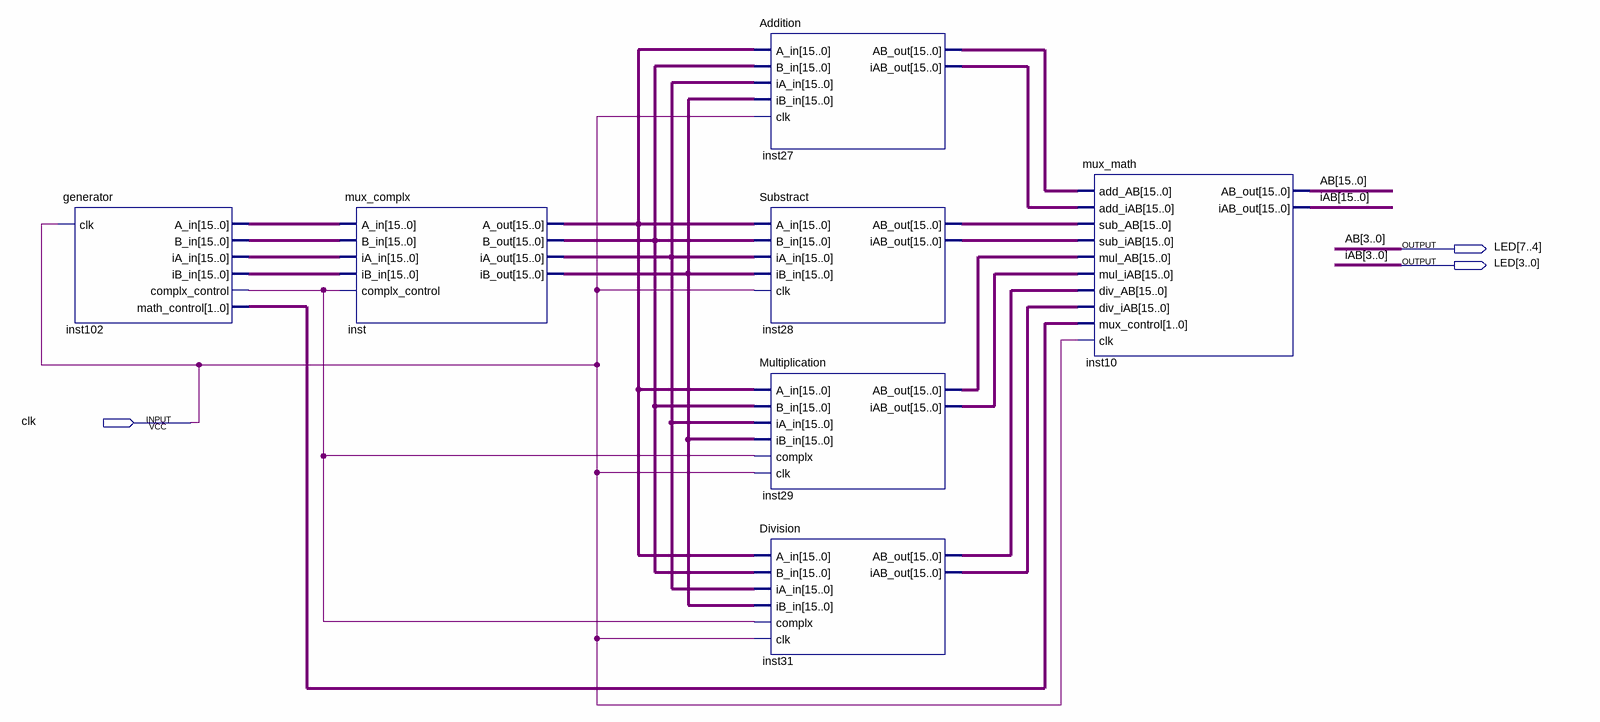
[diagram p0: schematic sheet]
// Quartus schematic Lab7.bdf as structural Verilog: 7 symbols, 3 pins
module Lab7 (
  input  clk,
  output [7:0] LED
);

  wire inst102_complx_control;
  wire [1:0] inst102_math_control;
  wire [15:0] inst27_ab_out, inst27_iab_out, inst28_ab_out, inst28_iab_out, inst29_ab_out, inst29_iab_out,
       inst31_ab_out, inst31_iab_out, inst102_a_in, inst102_b_in, inst102_ia_in, inst102_ib_in, inst_a_out,
       inst_b_out, inst_ia_out, inst_ib_out;
  wire [15:4] AB, iAB;

  generator inst102 (
    .clk(clk), .A_in(inst102_a_in), .B_in(inst102_b_in), .iA_in(inst102_ia_in), .iB_in(inst102_ib_in),
    .complx_control(inst102_complx_control), .math_control(inst102_math_control));
  mux_complx inst (
    .A_in(inst102_a_in), .B_in(inst102_b_in), .iA_in(inst102_ia_in), .iB_in(inst102_ib_in),
    .complx_control(inst102_complx_control), .A_out(inst_a_out), .B_out(inst_b_out), .iA_out(inst_ia_out),
    .iB_out(inst_ib_out));
  Addition inst27 (
    .A_in(inst_a_out), .B_in(inst_b_out), .iA_in(inst_ia_out), .iB_in(inst_ib_out), .clk(clk),
    .AB_out(inst27_ab_out), .iAB_out(inst27_iab_out));
  Substract inst28 (
    .A_in(inst_a_out), .B_in(inst_b_out), .iA_in(inst_ia_out), .iB_in(inst_ib_out), .clk(clk),
    .AB_out(inst28_ab_out), .iAB_out(inst28_iab_out));
  Multiplication inst29 (
    .A_in(inst_a_out), .B_in(inst_b_out), .iA_in(inst_ia_out), .iB_in(inst_ib_out),
    .complx(inst102_complx_control), .clk(clk), .AB_out(inst29_ab_out), .iAB_out(inst29_iab_out));
  Division inst31 (
    .A_in(inst_a_out), .B_in(inst_b_out), .iA_in(inst_ia_out), .iB_in(inst_ib_out),
    .complx(inst102_complx_control), .clk(clk), .AB_out(inst31_ab_out), .iAB_out(inst31_iab_out));
  mux_math inst10 (
    .add_AB(inst27_ab_out), .add_iAB(inst27_iab_out), .sub_AB(inst28_ab_out), .sub_iAB(inst28_iab_out),
    .mul_AB(inst29_ab_out), .mul_iAB(inst29_iab_out), .div_AB(inst31_ab_out), .div_iAB(inst31_iab_out),
    .mux_control(inst102_math_control), .clk(clk), .AB_out({AB, LED[7:4]}), .iAB_out({iAB, LED[3:0]}));

  // Other names for the same wires on the sheet: AB[3:0] = LED[7:4]; iAB[3:0] = LED[3:0]
endmodule
